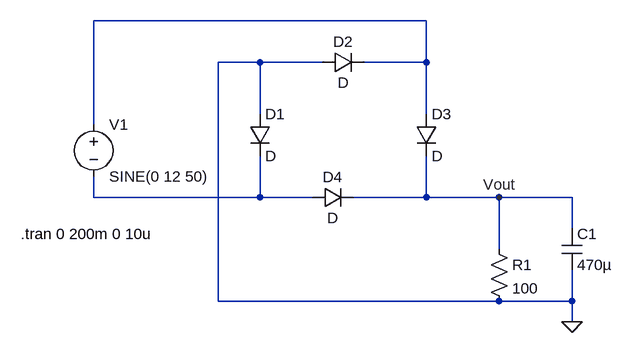
[diagram p0: schematic wave_rectifier_capacitor.asc]
wave_rectifier_capacitor.asc, the LTspice schematic file:
Version 4.1
SHEET 1 904 680
WIRE 544 -224 32 -224
WIRE 288 -160 224 -160
WIRE 384 -160 288 -160
WIRE 544 -160 544 -224
WIRE 544 -160 448 -160
WIRE 288 -80 288 -160
WIRE 544 -80 544 -160
WIRE 32 -64 32 -224
WIRE 32 48 32 16
WIRE 288 48 288 -16
WIRE 288 48 32 48
WIRE 368 48 288 48
WIRE 544 48 544 -16
WIRE 544 48 432 48
WIRE 656 48 544 48
WIRE 768 48 656 48
WIRE 768 96 768 48
WIRE 656 128 656 48
WIRE 224 208 224 -160
WIRE 656 208 224 208
WIRE 768 208 768 160
WIRE 768 208 656 208
WIRE 768 240 768 208
FLAG 656 48 Vout
FLAG 768 240 0
SYMBOL voltage 32 -80 R0
WINDOW 123 0 0 Left 0
WINDOW 39 0 0 Left 0
SYMATTR InstName V1
SYMATTR Value SINE(0 12 50)
SYMBOL diode 384 -144 R270
WINDOW 0 32 32 VTop 2
WINDOW 3 0 32 VBottom 2
SYMATTR InstName D2
SYMBOL diode 528 -80 R0
SYMATTR InstName D3
SYMBOL diode 368 64 R270
WINDOW 0 32 32 VTop 2
WINDOW 3 0 32 VBottom 2
SYMATTR InstName D4
SYMBOL diode 272 -80 R0
SYMATTR InstName D1
SYMBOL res 640 112 R0
SYMATTR InstName R1
SYMATTR Value 100
SYMBOL cap 752 96 R0
SYMATTR InstName C1
SYMATTR Value 470µ
TEXT -80 104 Left 2 !.tran 0 200m 0 10u

The netlist it stands for:
* wave_rectifier_capacitor.asc
V1 N001 N002 SINE(0 12 50)
D2 0 N001 D
D3 N001 Vout D
D4 N002 Vout D
D1 0 N002 D
R1 Vout 0 100
C1 Vout 0 470µ
.model D D
.lib standard.dio
.tran 0 200m 0 10u
.backanno
.end